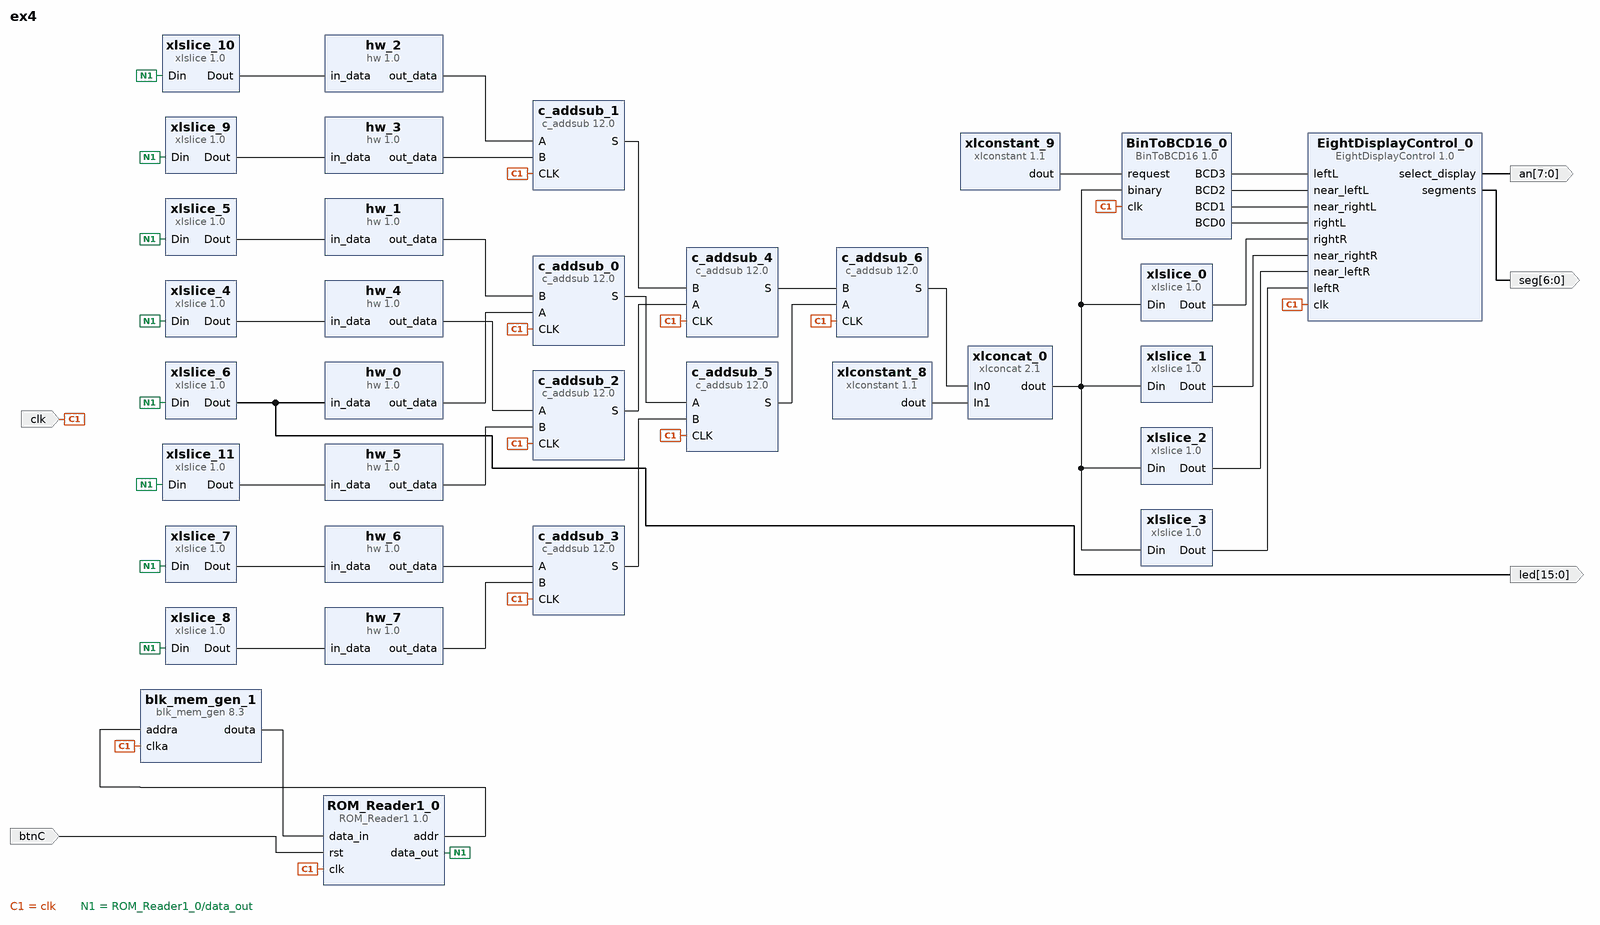
[diagram p0: block diagram of the top level]
# Vivado block design ex4, Vivado 2015.4
create_bd_design ex4

create_bd_port -dir I clk
create_bd_port -dir O -from 6 -to 0 seg
create_bd_port -dir O -from 7 -to 0 an
create_bd_port -dir I btnC
create_bd_port -dir O -from 15 -to 0 led

create_bd_cell -type ip -vlnv xilinx.com:ip:blk_mem_gen:8.3 blk_mem_gen_1
set_property -dict [list \
  CONFIG.Memory_Type Single_Port_ROM \
  CONFIG.Enable_32bit_Address false \
  CONFIG.Write_Width_A 16 \
  CONFIG.Write_Depth_A 8 \
  CONFIG.Enable_A Always_Enabled \
  CONFIG.Register_PortA_Output_of_Memory_Primitives false \
  CONFIG.Load_Init_File true \
  CONFIG.Coe_File ../../../../imports/Projects2016/8words_16bits.coe \
  CONFIG.Use_RSTA_Pin false \
  CONFIG.Port_A_Write_Rate 0 \
  CONFIG.use_bram_block Stand_Alone \
] [get_bd_cells blk_mem_gen_1]
create_bd_cell -type ip -vlnv user.org:user:hw:1.0 hw_0
create_bd_cell -type ip -vlnv user.org:user:hw:1.0 hw_1
create_bd_cell -type ip -vlnv user.org:user:hw:1.0 hw_2
create_bd_cell -type ip -vlnv user.org:user:hw:1.0 hw_3
create_bd_cell -type ip -vlnv user.org:user:hw:1.0 hw_4
create_bd_cell -type ip -vlnv user.org:user:hw:1.0 hw_5
create_bd_cell -type ip -vlnv user.org:user:hw:1.0 hw_6
create_bd_cell -type ip -vlnv user.org:user:hw:1.0 hw_7
create_bd_cell -type ip -vlnv xilinx.com:ip:c_addsub:12.0 c_addsub_0
set_property -dict [list \
  CONFIG.A_Type Unsigned \
  CONFIG.B_Type Unsigned \
  CONFIG.A_Width 5 \
  CONFIG.B_Width 5 \
  CONFIG.Out_Width 6 \
  CONFIG.Latency_Configuration Automatic \
  CONFIG.Latency 1 \
  CONFIG.B_Constant false \
  CONFIG.B_Value 00000 \
  CONFIG.CE false \
] [get_bd_cells c_addsub_0]
create_bd_cell -type ip -vlnv xilinx.com:ip:c_addsub:12.0 c_addsub_1
set_property -dict [list \
  CONFIG.A_Type Unsigned \
  CONFIG.B_Type Unsigned \
  CONFIG.A_Width 5 \
  CONFIG.B_Width 5 \
  CONFIG.Out_Width 6 \
  CONFIG.Latency_Configuration Automatic \
  CONFIG.Latency 1 \
  CONFIG.B_Constant false \
  CONFIG.B_Value 00000 \
  CONFIG.CE false \
] [get_bd_cells c_addsub_1]
create_bd_cell -type ip -vlnv xilinx.com:ip:c_addsub:12.0 c_addsub_2
set_property -dict [list \
  CONFIG.A_Type Unsigned \
  CONFIG.B_Type Unsigned \
  CONFIG.A_Width 5 \
  CONFIG.B_Width 5 \
  CONFIG.Out_Width 6 \
  CONFIG.Latency_Configuration Automatic \
  CONFIG.Latency 1 \
  CONFIG.B_Constant false \
  CONFIG.B_Value 00000 \
  CONFIG.CE false \
] [get_bd_cells c_addsub_2]
create_bd_cell -type ip -vlnv xilinx.com:ip:c_addsub:12.0 c_addsub_3
set_property -dict [list \
  CONFIG.A_Type Unsigned \
  CONFIG.B_Type Unsigned \
  CONFIG.A_Width 5 \
  CONFIG.B_Width 5 \
  CONFIG.Out_Width 6 \
  CONFIG.Latency_Configuration Automatic \
  CONFIG.Latency 1 \
  CONFIG.B_Constant false \
  CONFIG.B_Value 00000 \
  CONFIG.CE false \
] [get_bd_cells c_addsub_3]
create_bd_cell -type ip -vlnv xilinx.com:ip:c_addsub:12.0 c_addsub_4
set_property -dict [list \
  CONFIG.A_Type Unsigned \
  CONFIG.B_Type Unsigned \
  CONFIG.A_Width 6 \
  CONFIG.B_Width 6 \
  CONFIG.Out_Width 7 \
  CONFIG.Latency_Configuration Automatic \
  CONFIG.Latency 1 \
  CONFIG.B_Constant false \
  CONFIG.B_Value 000000 \
  CONFIG.CE false \
] [get_bd_cells c_addsub_4]
create_bd_cell -type ip -vlnv xilinx.com:ip:c_addsub:12.0 c_addsub_5
set_property -dict [list \
  CONFIG.A_Type Unsigned \
  CONFIG.B_Type Unsigned \
  CONFIG.A_Width 6 \
  CONFIG.B_Width 6 \
  CONFIG.Out_Width 7 \
  CONFIG.Latency_Configuration Automatic \
  CONFIG.Latency 1 \
  CONFIG.B_Constant false \
  CONFIG.B_Value 000000 \
  CONFIG.CE false \
] [get_bd_cells c_addsub_5]
create_bd_cell -type ip -vlnv xilinx.com:ip:c_addsub:12.0 c_addsub_6
set_property -dict [list \
  CONFIG.A_Type Unsigned \
  CONFIG.B_Type Unsigned \
  CONFIG.A_Width 7 \
  CONFIG.B_Width 7 \
  CONFIG.Out_Width 8 \
  CONFIG.Latency_Configuration Automatic \
  CONFIG.Latency 1 \
  CONFIG.B_Constant false \
  CONFIG.B_Value 0000000 \
  CONFIG.CE false \
] [get_bd_cells c_addsub_6]
create_bd_cell -type ip -vlnv xilinx.com:ip:xlconcat:2.1 xlconcat_0
set_property -dict {CONFIG.IN0_WIDTH 8 CONFIG.IN1_WIDTH 8} [get_bd_cells xlconcat_0]
create_bd_cell -type ip -vlnv xilinx.com:ip:xlconstant:1.1 xlconstant_8
set_property -dict {CONFIG.CONST_WIDTH 8 CONFIG.CONST_VAL 0} [get_bd_cells xlconstant_8]
create_bd_cell -type ip -vlnv ua.pt:user:BinToBCD16:1.0 BinToBCD16_0
create_bd_cell -type ip -vlnv ua.pt:user:EightDisplayControl:1.0 EightDisplayControl_0
create_bd_cell -type ip -vlnv xilinx.com:ip:xlconstant:1.1 xlconstant_9
create_bd_cell -type ip -vlnv xilinx.com:ip:xlslice:1.0 xlslice_0
set_property -dict {CONFIG.DOUT_WIDTH 4 CONFIG.DIN_TO 0 CONFIG.DIN_FROM 3 CONFIG.DIN_WIDTH 16} [get_bd_cells xlslice_0]
create_bd_cell -type ip -vlnv xilinx.com:ip:xlslice:1.0 xlslice_1
set_property -dict {CONFIG.DOUT_WIDTH 4 CONFIG.DIN_TO 4 CONFIG.DIN_FROM 7 CONFIG.DIN_WIDTH 16} [get_bd_cells xlslice_1]
create_bd_cell -type ip -vlnv xilinx.com:ip:xlslice:1.0 xlslice_2
set_property -dict {CONFIG.DOUT_WIDTH 4 CONFIG.DIN_TO 8 CONFIG.DIN_FROM 11 CONFIG.DIN_WIDTH 16} [get_bd_cells xlslice_2]
create_bd_cell -type ip -vlnv xilinx.com:ip:xlslice:1.0 xlslice_3
set_property -dict {CONFIG.DOUT_WIDTH 4 CONFIG.DIN_TO 12 CONFIG.DIN_FROM 15 CONFIG.DIN_WIDTH 16} [get_bd_cells xlslice_3]
create_bd_cell -type ip -vlnv user.org:user:ROM_Reader1:1.0 ROM_Reader1_0
set_property -dict {CONFIG.data_width 16 CONFIG.address_bits 3} [get_bd_cells ROM_Reader1_0]
create_bd_cell -type ip -vlnv xilinx.com:ip:xlslice:1.0 xlslice_4
set_property -dict {CONFIG.DOUT_WIDTH 16 CONFIG.DIN_TO 96 CONFIG.DIN_FROM 111 CONFIG.DIN_WIDTH 128} [get_bd_cells xlslice_4]
create_bd_cell -type ip -vlnv xilinx.com:ip:xlslice:1.0 xlslice_5
set_property -dict {CONFIG.DOUT_WIDTH 16 CONFIG.DIN_TO 16 CONFIG.DIN_FROM 31 CONFIG.DIN_WIDTH 128} [get_bd_cells xlslice_5]
create_bd_cell -type ip -vlnv xilinx.com:ip:xlslice:1.0 xlslice_6
set_property -dict {CONFIG.DOUT_WIDTH 16 CONFIG.DIN_TO 0 CONFIG.DIN_FROM 15 CONFIG.DIN_WIDTH 128} [get_bd_cells xlslice_6]
create_bd_cell -type ip -vlnv xilinx.com:ip:xlslice:1.0 xlslice_7
set_property -dict {CONFIG.DOUT_WIDTH 16 CONFIG.DIN_TO 32 CONFIG.DIN_FROM 47 CONFIG.DIN_WIDTH 128} [get_bd_cells xlslice_7]
create_bd_cell -type ip -vlnv xilinx.com:ip:xlslice:1.0 xlslice_8
set_property -dict {CONFIG.DOUT_WIDTH 16 CONFIG.DIN_TO 48 CONFIG.DIN_FROM 63 CONFIG.DIN_WIDTH 128} [get_bd_cells xlslice_8]
create_bd_cell -type ip -vlnv xilinx.com:ip:xlslice:1.0 xlslice_9
set_property -dict {CONFIG.DOUT_WIDTH 16 CONFIG.DIN_TO 80 CONFIG.DIN_FROM 95 CONFIG.DIN_WIDTH 128} [get_bd_cells xlslice_9]
create_bd_cell -type ip -vlnv xilinx.com:ip:xlslice:1.0 xlslice_10
set_property -dict {CONFIG.DOUT_WIDTH 16 CONFIG.DIN_TO 64 CONFIG.DIN_FROM 79 CONFIG.DIN_WIDTH 128} [get_bd_cells xlslice_10]
create_bd_cell -type ip -vlnv xilinx.com:ip:xlslice:1.0 xlslice_11
set_property -dict {CONFIG.DOUT_WIDTH 16 CONFIG.DIN_TO 112 CONFIG.DIN_FROM 127 CONFIG.DIN_WIDTH 128} [get_bd_cells xlslice_11]

# ---- connections ----

connect_bd_net [get_bd_ports clk] \
  [get_bd_pins blk_mem_gen_1/clka] [get_bd_pins c_addsub_1/CLK] [get_bd_pins c_addsub_2/CLK] [get_bd_pins c_addsub_3/CLK] \
  [get_bd_pins c_addsub_4/CLK] [get_bd_pins c_addsub_5/CLK] [get_bd_pins c_addsub_6/CLK] [get_bd_pins c_addsub_0/CLK] \
  [get_bd_pins BinToBCD16_0/clk] [get_bd_pins EightDisplayControl_0/clk] [get_bd_pins ROM_Reader1_0/clk]
connect_bd_net [get_bd_pins hw_0/out_data] [get_bd_pins c_addsub_0/A]
connect_bd_net [get_bd_pins hw_1/out_data] [get_bd_pins c_addsub_0/B]
connect_bd_net [get_bd_pins hw_3/out_data] [get_bd_pins c_addsub_1/B]
connect_bd_net [get_bd_pins hw_2/out_data] [get_bd_pins c_addsub_1/A]
connect_bd_net [get_bd_pins hw_4/out_data] [get_bd_pins c_addsub_2/A]
connect_bd_net [get_bd_pins hw_5/out_data] [get_bd_pins c_addsub_2/B]
connect_bd_net [get_bd_pins hw_6/out_data] [get_bd_pins c_addsub_3/A]
connect_bd_net [get_bd_pins hw_7/out_data] [get_bd_pins c_addsub_3/B]
connect_bd_net [get_bd_pins c_addsub_1/S] [get_bd_pins c_addsub_4/B]
connect_bd_net [get_bd_pins c_addsub_2/S] [get_bd_pins c_addsub_4/A]
connect_bd_net [get_bd_pins c_addsub_3/S] [get_bd_pins c_addsub_5/B]
connect_bd_net [get_bd_pins c_addsub_0/S] [get_bd_pins c_addsub_5/A]
connect_bd_net [get_bd_pins c_addsub_5/S] [get_bd_pins c_addsub_6/A]
connect_bd_net [get_bd_pins c_addsub_4/S] [get_bd_pins c_addsub_6/B]
connect_bd_net [get_bd_pins xlconstant_8/dout] [get_bd_pins xlconcat_0/In1]
connect_bd_net [get_bd_pins xlconcat_0/dout] \
  [get_bd_pins BinToBCD16_0/binary] [get_bd_pins xlslice_0/Din] [get_bd_pins xlslice_1/Din] [get_bd_pins xlslice_2/Din] \
  [get_bd_pins xlslice_3/Din]
connect_bd_net [get_bd_pins xlconstant_9/dout] [get_bd_pins BinToBCD16_0/request]
connect_bd_net [get_bd_pins EightDisplayControl_0/segments] [get_bd_ports seg]
connect_bd_net [get_bd_pins EightDisplayControl_0/select_display] [get_bd_ports an]
connect_bd_net [get_bd_pins BinToBCD16_0/BCD3] [get_bd_pins EightDisplayControl_0/leftL]
connect_bd_net [get_bd_pins BinToBCD16_0/BCD2] [get_bd_pins EightDisplayControl_0/near_leftL]
connect_bd_net [get_bd_pins BinToBCD16_0/BCD1] [get_bd_pins EightDisplayControl_0/near_rightL]
connect_bd_net [get_bd_pins BinToBCD16_0/BCD0] [get_bd_pins EightDisplayControl_0/rightL]
connect_bd_net [get_bd_pins c_addsub_6/S] [get_bd_pins xlconcat_0/In0]
connect_bd_net [get_bd_pins xlslice_0/Dout] [get_bd_pins EightDisplayControl_0/rightR]
connect_bd_net [get_bd_pins xlslice_1/Dout] [get_bd_pins EightDisplayControl_0/near_rightR]
connect_bd_net [get_bd_pins xlslice_2/Dout] [get_bd_pins EightDisplayControl_0/near_leftR]
connect_bd_net [get_bd_pins xlslice_3/Dout] [get_bd_pins EightDisplayControl_0/leftR]
connect_bd_net [get_bd_pins ROM_Reader1_0/addr] [get_bd_pins blk_mem_gen_1/addra]
connect_bd_net [get_bd_pins blk_mem_gen_1/douta] [get_bd_pins ROM_Reader1_0/data_in]
connect_bd_net [get_bd_ports btnC] [get_bd_pins ROM_Reader1_0/rst]
connect_bd_net [get_bd_pins xlslice_4/Dout] [get_bd_pins hw_4/in_data]
connect_bd_net [get_bd_pins xlslice_8/Dout] [get_bd_pins hw_7/in_data]
connect_bd_net [get_bd_pins xlslice_7/Dout] [get_bd_pins hw_6/in_data]
connect_bd_net [get_bd_pins xlslice_6/Dout] [get_bd_pins hw_0/in_data] [get_bd_ports led]
connect_bd_net [get_bd_pins xlslice_11/Dout] [get_bd_pins hw_5/in_data]
connect_bd_net [get_bd_pins xlslice_10/Dout] [get_bd_pins hw_2/in_data]
connect_bd_net [get_bd_pins xlslice_9/Dout] [get_bd_pins hw_3/in_data]
connect_bd_net [get_bd_pins ROM_Reader1_0/data_out] \
  [get_bd_pins xlslice_9/Din] [get_bd_pins xlslice_10/Din] [get_bd_pins xlslice_6/Din] [get_bd_pins xlslice_5/Din] \
  [get_bd_pins xlslice_7/Din] [get_bd_pins xlslice_8/Din] [get_bd_pins xlslice_4/Din] [get_bd_pins xlslice_11/Din]
connect_bd_net [get_bd_pins xlslice_5/Dout] [get_bd_pins hw_1/in_data]

validate_bd_design
save_bd_design
